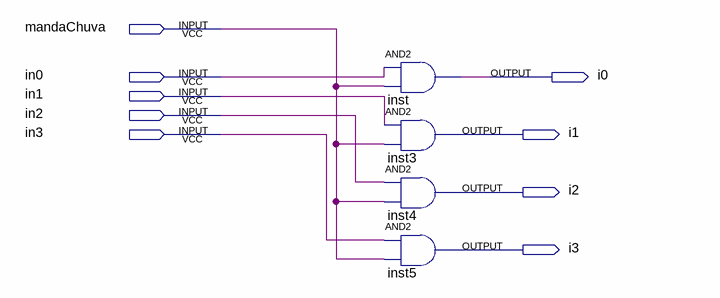
[diagram p0: schematic sheet]
// Quartus schematic mandachuva.bdf as structural Verilog: 4 symbols, 9 pins
module mandachuva (
  input  mandaChuva,
  input  in0,
  input  in1,
  input  in2,
  input  in3,
  output i0,
  output i1,
  output i2,
  output i3
);

  and inst (i0, in0, mandaChuva);
  and inst3 (i1, in1, mandaChuva);
  and inst4 (i2, in2, mandaChuva);
  and inst5 (i3, in3, mandaChuva);
endmodule
